# Altium schematic sheet ConverterSch_Draft.SchDoc
size A3; Author: Author; Organization: Altium Limited; Address1: L3, 12a Rodborough Rd; Address2: Frenchs Forest; Address3: NSW; Address4: Australia 2086
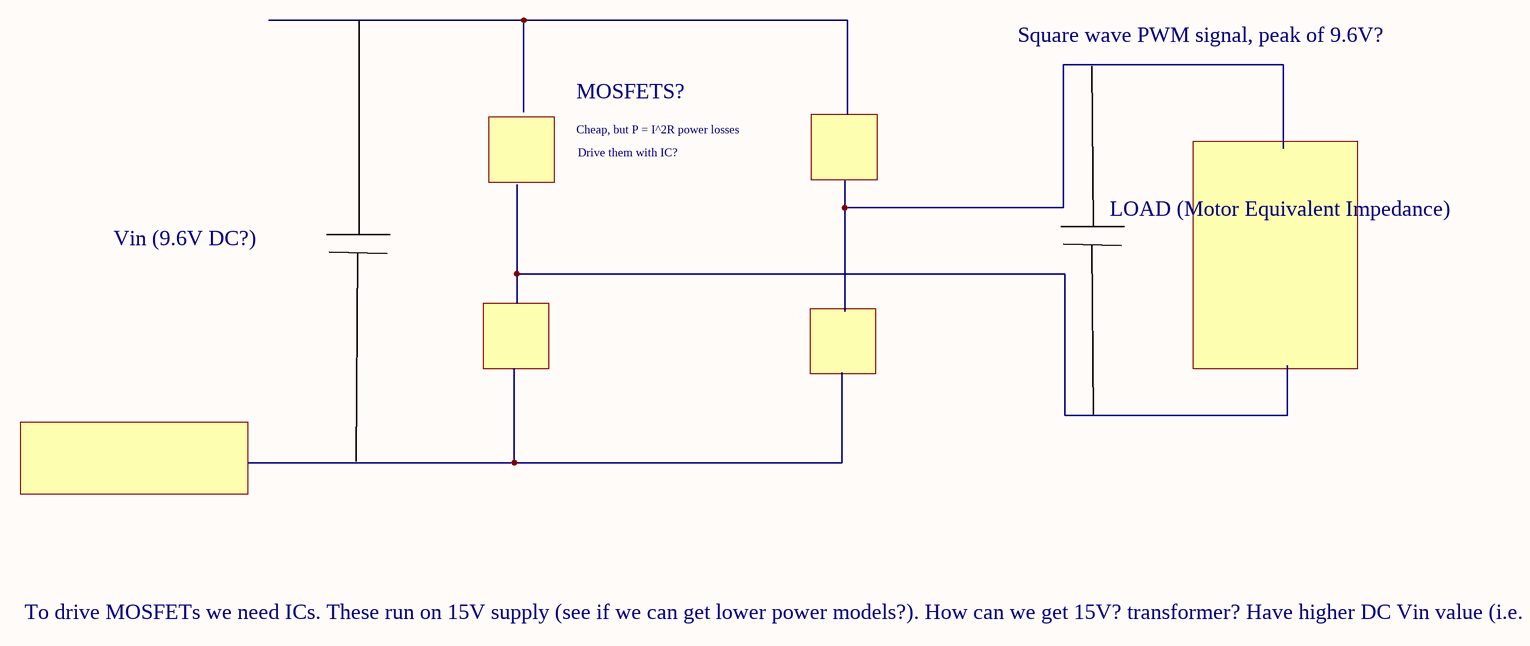
[diagram p0: ConverterSch_Draft.SchDoc]

## Notes on the sheet
- Square wave PWM signal, peak of 9.6V?
- MOSFETS?
- Cheap, but P = I^2R power losses
- Drive them with IC?
- LOAD (Motor Equivalent Impedance)
- Vin (9.6V DC?)
- Voltage+Current Sensor?
- To drive MOSFETs we need ICs. These run on 15V supply (see if we can get lower power models?). How can we get 15V? transformer? Have higher DC Vin value (i.e. 15V), and decrease the voltage for the square wave?
- Title:
- Author:
- Date:
- Time:
- Revision:
- Sheet
- of
- File: